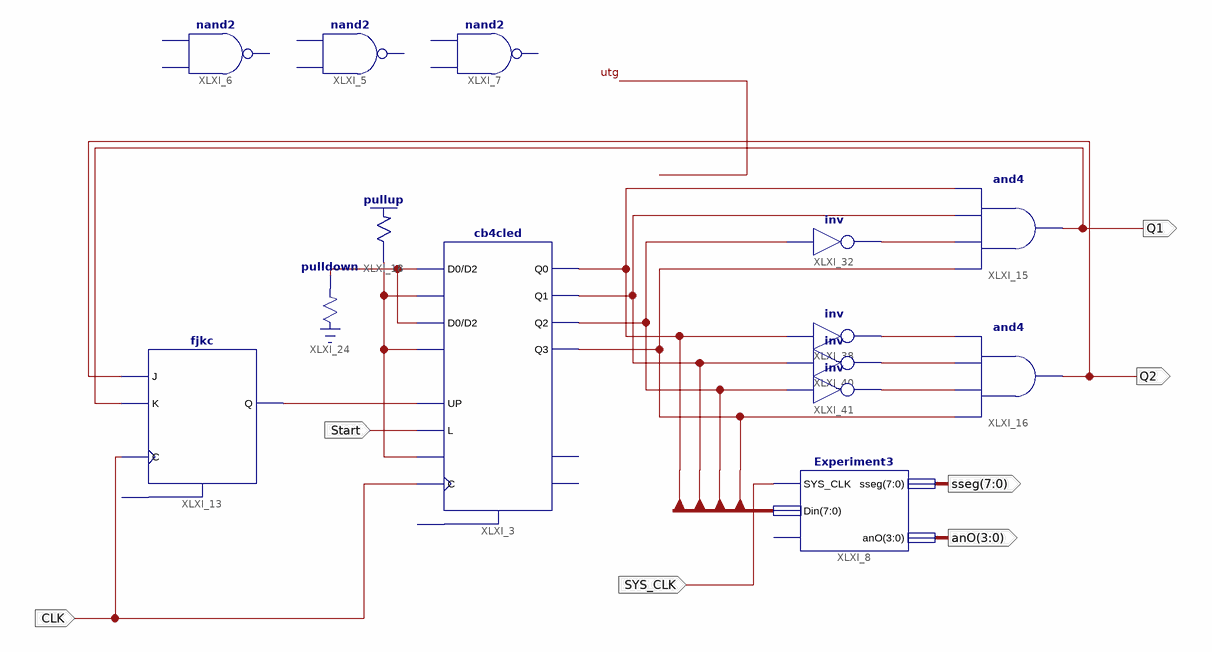
[diagram p0: schematic sheet 1]
// Xilinx ISE schematic Experiment7.sch (spartan3e) as structural Verilog: 14 symbols, 7 ports
module Experiment7 (
  input  CLK,
  input  SYS_CLK,
  input  Start,
  output [7:0] sseg,
  output [3:0] anO,
  output Q2,
  output Q1
);

  wire XLXN_27, XLXN_95, XLXN_103, XLXN_149, XLXN_155, XLXN_156, XLXN_157;
  wire [7:0] Din;

  cb4cled XLXI_3 (
    .C(CLK), .CE(XLXN_27), .D0(XLXN_95), .D1(XLXN_27), .D2(XLXN_95), .D3(XLXN_27), .L(Start), .UP(XLXN_103),
    .Q0(Din[0]), .Q1(Din[1]), .Q2(Din[2]), .Q3(Din[3]));  // open: CLR, CEO, TC
  // nand2 XLXI_5 is placed but not wired
  // nand2 XLXI_6 is placed but not wired
  // nand2 XLXI_7 is placed but not wired
  Experiment3 XLXI_8 (.SYS_CLK(SYS_CLK), .Din(Din), .sseg(sseg), .anO(anO));  // open: En
  fjkc XLXI_13 (.C(CLK), .J(Q2), .K(Q1), .Q(XLXN_103));  // open: CLR
  and XLXI_15 (Q1, Din[3], XLXN_149, Din[1], Din[0]);
  and XLXI_16 (Q2, Din[3], XLXN_155, XLXN_156, XLXN_157);
  \pullup  XLXI_18 (.O(XLXN_27));
  \pulldown  XLXI_24 (.O(XLXN_95));
  not XLXI_32 (XLXN_149, Din[2]);
  not XLXI_38 (XLXN_157, Din[0]);
  not XLXI_40 (XLXN_156, Din[1]);
  not XLXI_41 (XLXN_155, Din[2]);
endmodule
